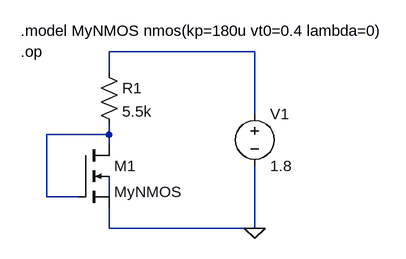
[diagram p0: schematic DC Analysis in LTspice.asc]
DC Analysis in LTspice.asc, the LTspice schematic file:
Version 4
SHEET 1 880 680
WIRE 336 16 112 16
WIRE 112 48 112 16
WIRE 336 112 336 16
WIRE 112 144 112 128
WIRE 112 144 16 144
WIRE 112 160 112 144
WIRE 16 240 16 144
WIRE 64 240 16 240
WIRE 112 240 112 208
WIRE 112 288 112 256
WIRE 336 288 336 192
WIRE 336 288 112 288
FLAG 336 288 0
SYMBOL nmos4 64 160 R0
SYMATTR InstName M1
SYMATTR Value MyNMOS
SYMATTR Value2 l=1u w=25u
SYMBOL res 96 32 R0
SYMATTR InstName R1
SYMATTR Value 5.5k
SYMBOL voltage 336 96 R0
WINDOW 123 0 0 Left 0
WINDOW 39 0 0 Left 0
SYMATTR InstName V1
SYMATTR Value 1.8
TEXT -24 -16 Left 2 !.model MyNMOS nmos(kp=180u vt0=0.4 lambda=0)
TEXT -24 16 Left 2 !.op

The netlist it stands for:
* DC Analysis in LTspice.asc
M1 N002 N002 0 N003 MyNMOS l=1u w=25u
R1 N001 N002 5.5k
V1 N001 0 1.8
.model NMOS NMOS
.model PMOS PMOS
.lib standard.mos
.model MyNMOS nmos(kp=180u vt0=0.4 lambda=0)
.op
.backanno
.end